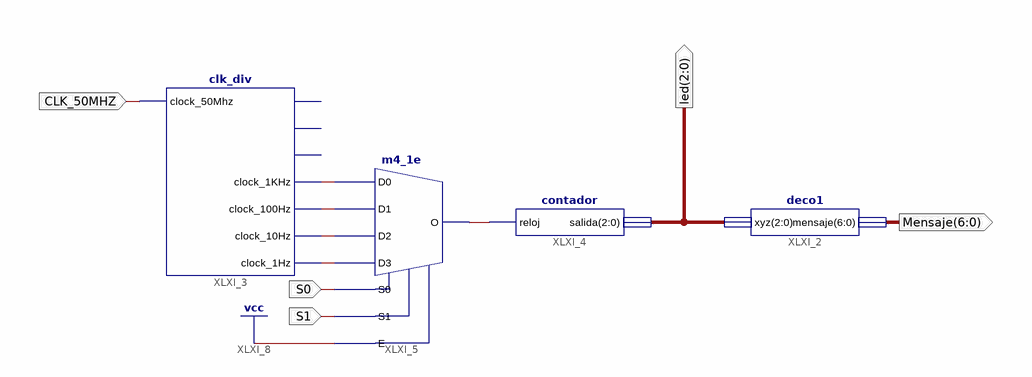
[diagram p0: schematic sheet 1]
// Xilinx ISE schematic vojabesTodo.sch (spartan3e) as structural Verilog: 4 symbols, 5 ports
module vojabesTodo (
  input  CLK_50MHZ,
  input  S0,
  input  S1,
  output [2:0] led,
  output [6:0] Mensaje
);

  wire XLXN_2, XLXN_5, XLXN_6, XLXN_7, XLXN_8;

  deco1 XLXI_2 (.xyz(led), .mensaje(Mensaje));
  clk_div XLXI_3 (
    .clock_50Mhz(CLK_50MHZ), .clock_1KHz(XLXN_5), .clock_100Hz(XLXN_6), .clock_10Hz(XLXN_7),
    .clock_1Hz(XLXN_8));  // open: clock_1MHz, clock_100KHz, clock_10KHz
  m4_1e XLXI_5 (.D0(XLXN_5), .D1(XLXN_6), .D2(XLXN_7), .D3(XLXN_8), .E(1'b1), .S0(S0), .S1(S1), .O(XLXN_2));
  contador XLXI_4 (.reloj(XLXN_2), .salida(led));
endmodule
